# Altium schematic sheet other.SchDoc
size A2; SheetNumber: 3; SheetTotal: 3
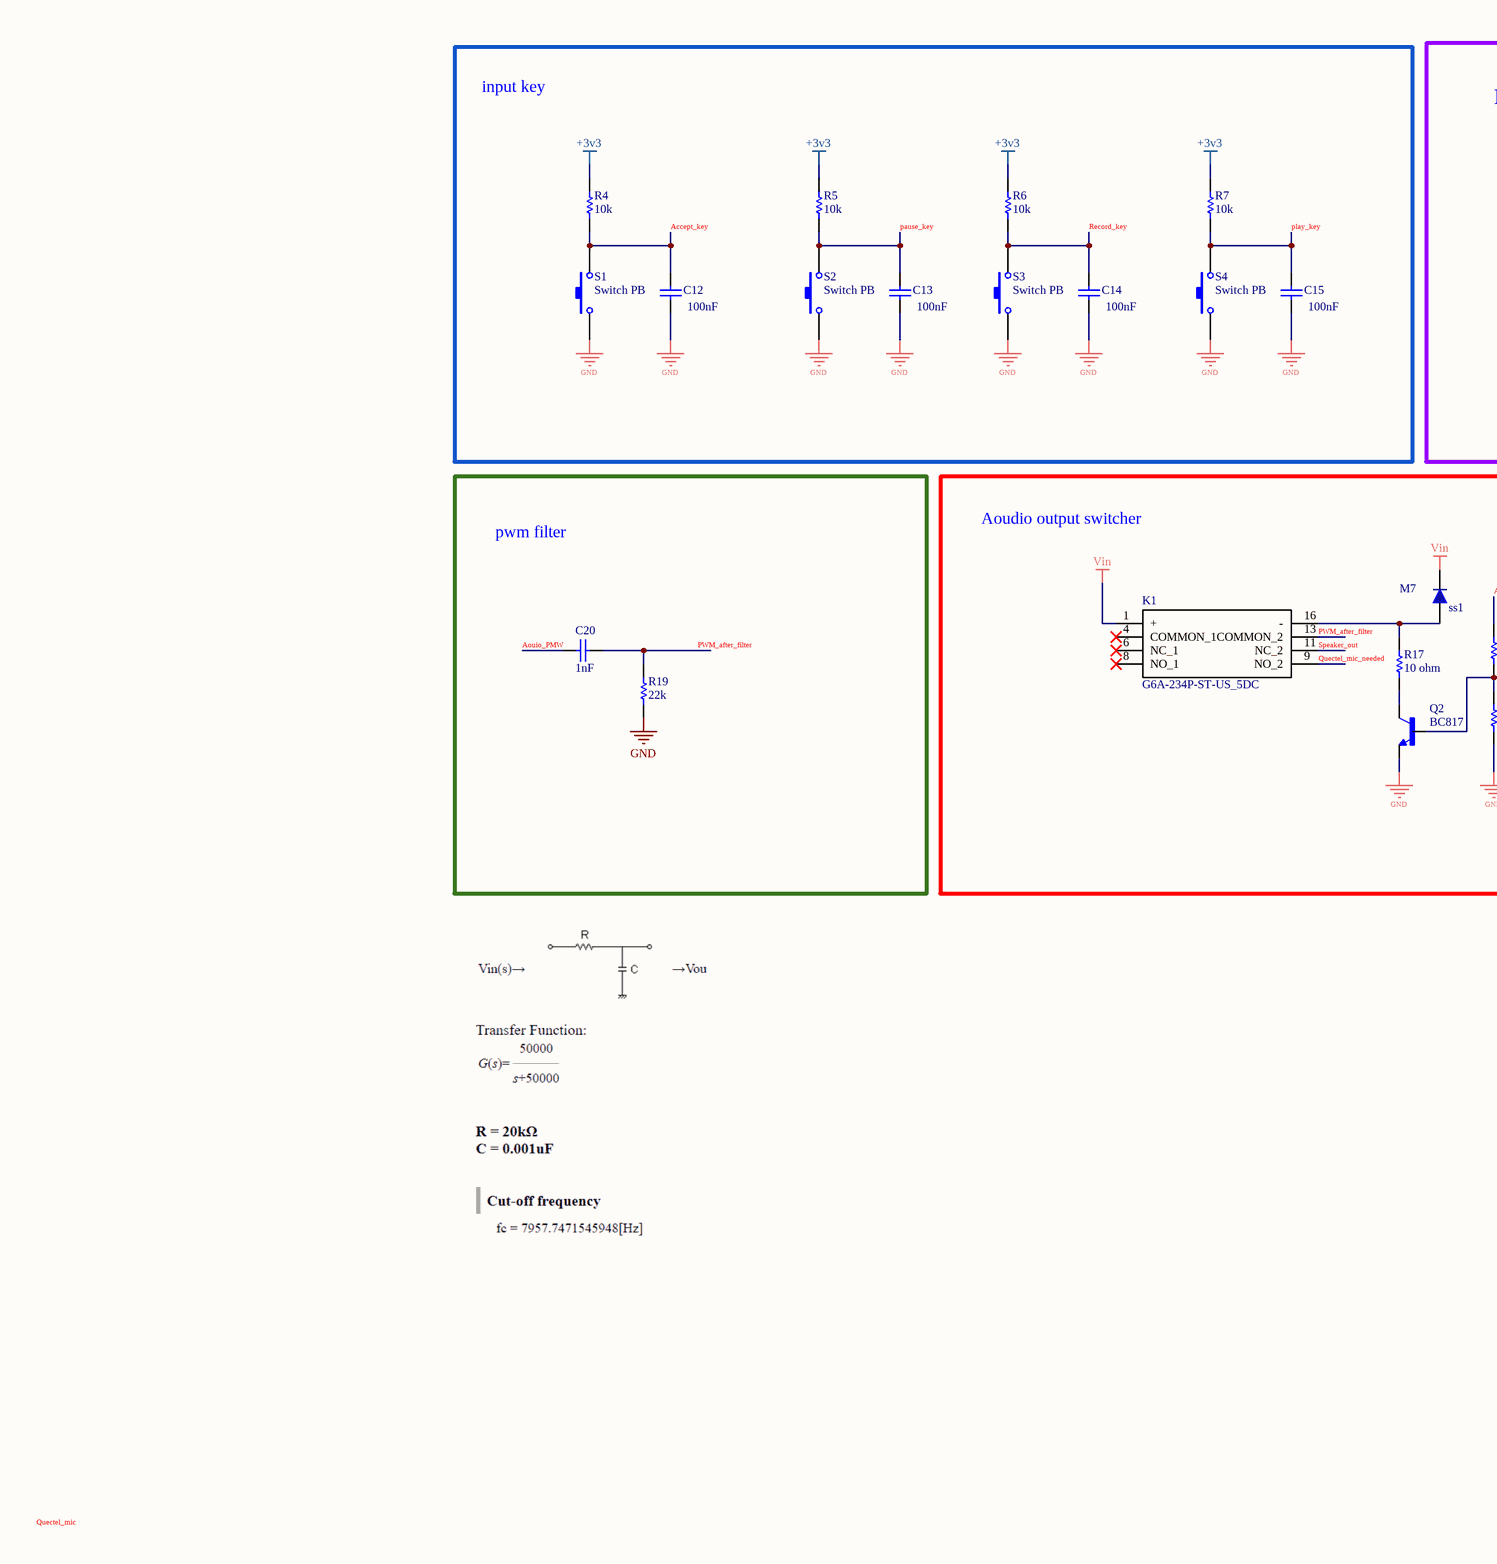
[diagram p0: other.SchDoc, left]
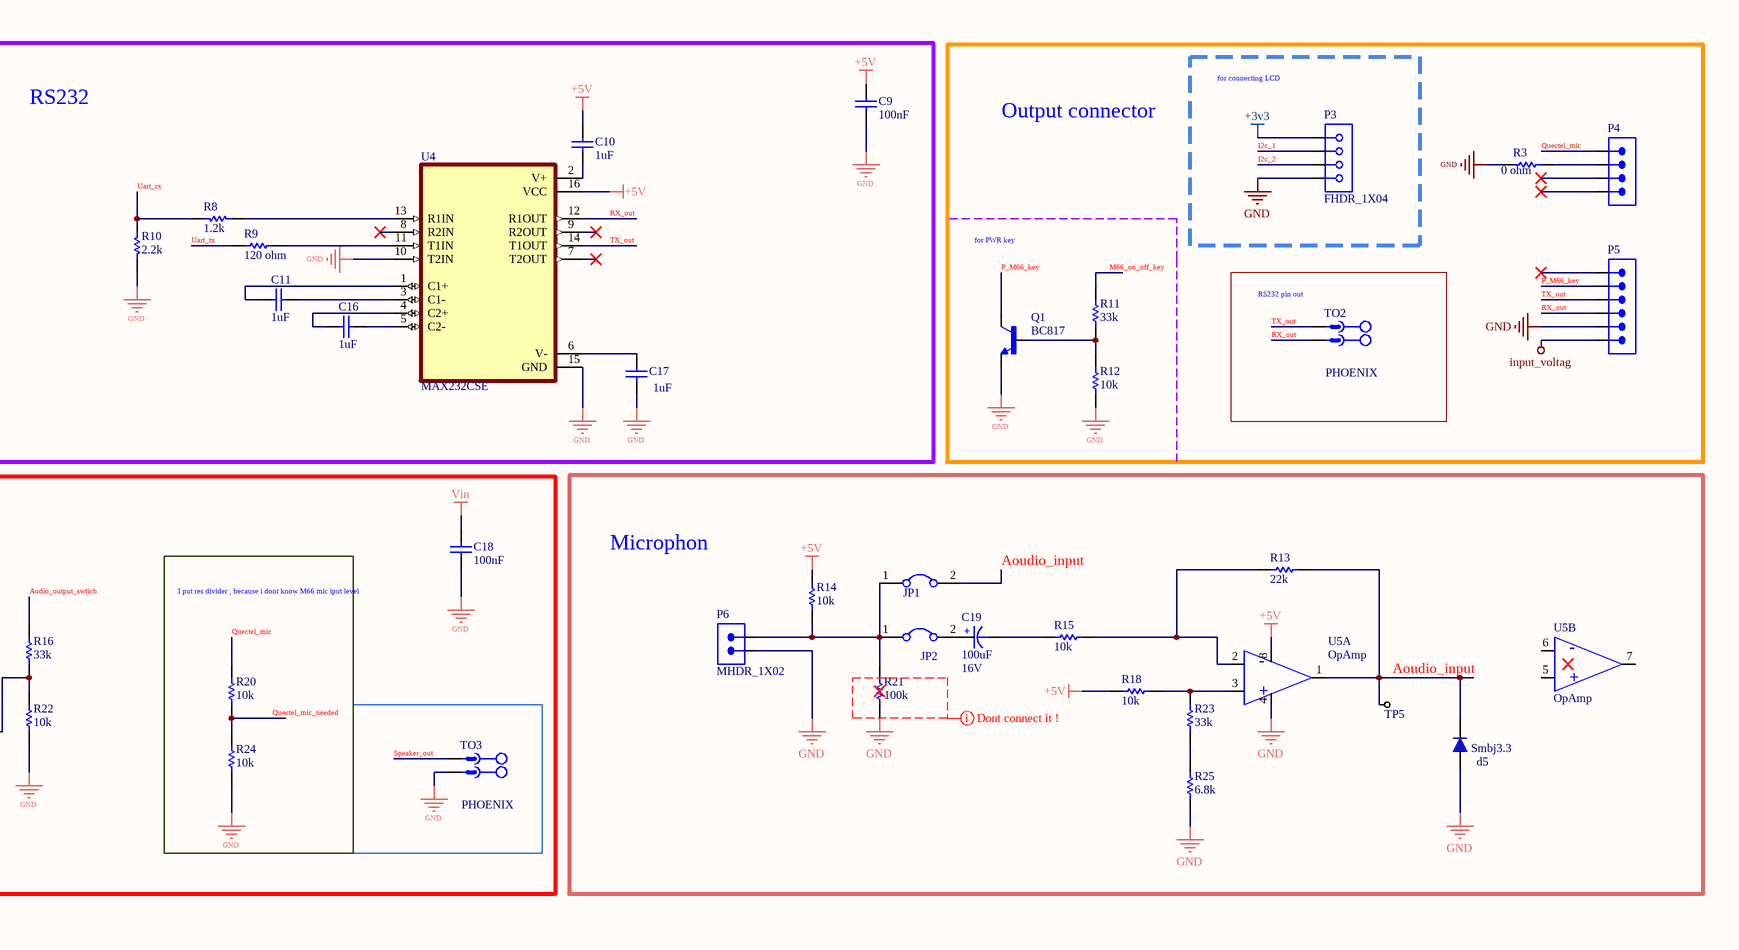
[diagram p1: other.SchDoc, right]

## Parts
C9  value 100nF  [CAP805]
C10  value 1uF  [CAP805]
C11  value 1uF  [CAP805]
C12  value 100nF  [CAP805]
C13  value 100nF  [CAP805]
C14  value 100nF  [CAP805]
C15  value 100nF  [CAP805]
C16  value 1uF  [CAP805]
C17  value 1uF  [CAP805]
C18  value 100nF  [CAP805]
C19  Voltage: 16V  [cap 03]  (hidden comment: 100uF)
C20  value 1nF  [CAP805]
d5  Smbj3.3  [DIODE SMA (DO-214AC)]
JP1  Jumper  [Jumper Small - 2.54 - GRAY]  (value not drawn)
JP2  Jumper  [Jumper Small - 2.54 - GRAY]  (value not drawn)
K1  G6A-234P-ST-US_5DC  [G6A234PSTUS5DC]
P3  FHDR_1X04  [FHDR1X04-254P]
P4  xh 4pin  [XH 4 PIN-S]  (value not drawn)
P5  xh 6pin  [XH 6 PIN-S]  (value not drawn)
P6  MHDR_1X02  [MHDR1X02-254P]
Q1  BC817  [SOT95P230X110-3N]
Q2  BC817  [SOT95P230X110-3N]
R3  0 ohm  [RES0805]
R4  10k  [RES0805]
R5  10k  [RES0805]
R6  10k  [RES0805]
R7  10k  [RES0805]
R8  1.2k  [RES0805]
R9  120 ohm  [RES0805]
R10  2.2k  [RES0805]
R11  33k  [RES0805]
R12  10k  [RES0805]
R13  22k  [RES0805]
R14  10k  [RES0805]
R15  10k  [RES0805]
R16  33k  [RES0805]
R17  10 ohm  [RES0805]
R18  10k  [RES0805]
R19  22k  [RES0805]
R20  10k  [RES0805]
R21  100k  [RES0805]
R22  10k  [RES0805]
R23  33k  [RES0805]
R24  10k  [RES0805]
R25  6.8k  [RES0805]
S1  Switch PB  [Switch - Push to On]
S2  Switch PB  [Switch - Push to On]
S3  Switch PB  [Switch - Push to On]
S4  Switch PB  [Switch - Push to On]
ss1  M7  [DIODE SMA (DO-214AC)]
TO2  PHOENIX  [CON_MSTBA02]
TO3  PHOENIX  [CON_MSTBA02]
TP5  (no value)  [TP10]
U4  MAX232CSE  [SOIC127P600X175-16N]
U5  OpAmp  [DIP8]  (parts A,B of 2)

## Blocks framed on the sheet
RS232: C9-C11 C16 C17 R8-R10 U4
input key: C12-C15 R4-R7 S1-S4
Output connector: P4 P5 Q1 R3 R11 R12
for connecting LCD: P3
RS232 pin out: TO2
Microphon: C19 d5 JP1 JP2 P6 R13-R15 R18 R21 R23 R25 TP5 U5
pwm filter: C20 R19
Aoudio output switcher: C18 K1 Q2 R16 R17 R22 ss1 TO3
I put res divider , because i dont know M66 mic iput level: R20 R24

## Nets
+3v3: P3.1 R4.2 R5.2 R6.2 R7.2
+5V: C9.1 C10.1 R14.2 R18.2 U4.16(VCC) U5.8(V+)
GND: C9.2 C12.1 C13.1 C14.1 C15.1 C17.1 C18.2 d5.1 P3.4 P5.5 P6.1 Q1.2(E) Q2.2(E) R3.2 R10.1 R12.2 R19.1 R21.2 R22.2 R24.2 R25.2 S1.1 S2.1 S3.1 S4.1 TO3.2 U4.10(T2IN) U4.15(GND) U5.4(V-)
input_voltag: P5.6
Vin: C18.1 K1.1(+) ss1.2
Accept_key: C12.2 R4.1 S1.2
Aoudio_input: d5.2 JP1.2 R13.1 TP5.1(TP) U5.1(Output)
Aouio_PMW: C20.2
Audio_output_swtich: R16.1
I2c_1: P3.2
I2c_2: P3.3
M66_on_off_key: R11.1
P_M66_key: P5.2 Q1.3(C)
pause_key: C13.2 R5.1 S2.2
play_key: C15.2 R7.1 S4.2
PWM_after_filter: C20.1 K1.13(COMMON_2) R19.2
Quectel_mic: P4.1 R20.1
Quectel_mic_needed: K1.9(NO_2) R20.2 R24.1
Record_key: C14.2 R6.1 S3.2
RX_out: P5.4 TO2.2 U4.12(R1OUT)
Speaker_out: K1.11(NC_2) TO3.1
TX_out: P5.3 TO2.1 U4.14(T1OUT)
Uart_rx: R8.1 R10.2
Uart_tx: R9.2
NetC10_2: C10.2 U4.2(V+)
NetC11_1: C11.1 U4.3(C1-)
NetC11_2: C11.2 U4.1(C1+)
NetC16_1: C16.1 U4.5(C2-)
NetC16_2: C16.2 U4.4(C2+)
NetC17_2: C17.2 U4.6(V-)
NetC19_1: C19.1(+) JP2.2
NetC19_2: C19.2(-) R15.2
NetJP1_1: JP1.1 JP2.1 P6.2 R14.1 R21.1
NetK1_16: K1.16(-) R17.1 ss1.1
NetP4_2: P4.2 R3.1
NetQ1_1: Q1.1(B) R11.2 R12.1
NetQ2_1: Q2.1(B) R16.2 R22.1
NetQ2_3: Q2.3(C) R17.2
NetR8_2: R8.2 U4.13(R1IN)
NetR9_1: R9.1 U4.11(T1IN)
NetR13_2: R13.2 R15.1 U5.2(Inverter_Input)
NetR18_1: R18.1 R23.1 U5.3(Noninverter_Input)
NetR23_2: R23.2 R25.1

Not connected (* = marked no-connect by the designer): K1 4(COMMON_1)* 6(NC_1)* 8(NO_1)*; P4 3* 4*; P5 1*; U4 7(T2OUT)* 8(R2IN)* 9(R2OUT)*; U5 5(Noninverter_Input) 6(Inverter_Input) 7(Output)

## Layout directives
mark named Dont connect it !: GND

## Notes on the sheet
- for PWR key
- Labels drawn without touching a wire or pin: Quectel_mic
- (in symbol OpAmp, part A) -; +
- (in symbol OpAmp, part B) -; +

## Library data of the parts
C9-C18 C20 = Cap: Capacitor; Published: 8-Jun-2000; LatestRevisionDate: 17-Jul-2002; LatestRevisionNote: Re-released for DXP Platform.; Publisher: Altium Limited
C19 = CAP_Polar: Polar Capacitor; Designer: Eng. Saeid Jorablo; Company: SJ Libraries; ComponentLink1Description: Datasheet; ComponentLink2Description: Reference; Publisher: SJ Unlimited; Mounting Technology: Surface Mount\Through-Hole; HelpURL: http://s3.picofile.com/file/7443264187/Coming_Soon_logo.gif; Status: Unreleased; Value: 100uF
d5 = 1n4007 SMD M7: Smbj5.0; Part. No: M7; Manufacturer: DC COMPONENTS; Designer: Abbas Basereh; Link: http://www.tme.eu/en/details/m7/smd-universal-diodes/dc-components/; Link: https://www.aliexpress.com/item/Smd-tube-1n4007-m7-SMA/1213719741.html?spm=2114.01010208.3.1.ZyZ7bC&ws_ab_test=searchweb0_0,searchweb201602_4_10065_10068_10084_10083_10080_10082_10081_10060_10061_10062_10056_10055_10054_10059_10099_10078_10079_427_10073_10103_10102_10096_10052_10050_10051,searchweb201603_4&btsid=db2be5ca-e560-400a-b91c-484ab5ee228b; Data: 16-12-2016
JP1 JP2 = Jumper: Company: E.P.I.L; Defualt State: Close; Design Date: 2011/11/02
K1 = G6A-234P-ST-US_5DC: Relay or Contactor; Manufacturer_Name: Omron Electronics; Manufacturer_Part_Number: G6A-234P-ST-US 5DC; Datasheet Link: https://componentsearchengine.com/Datasheets/2/G6A-234P-ST-US 5DC.pdf; Height: 8.4mm; Arrow Part Number: G6A-234P-ST-US 5DC; Arrow Price/Stock: https://www.arrow.com/en/products/g6a234pstus5dc/omron
P3 = FHDR_1X04: Female Header 1X04
P4 = MHDR_1X04
P5 = MHDR_1X06
P6 = MHDR_1X02: Male Header 1X02
Q1 Q2 = BC817: Transistor, Npn, 0.5a, 45v, Sot23; MF: {'manufacturer': u'Rectron'}; MP: BC817; Package: None; Availability: Unavailable; Price: None; Value: *
R3 R11 R12 R16 R17 R20 R22 R24 = RES 0805 0.125W_5: RES 0805; Designer: Abbas Basereh; Desc.: RES SMD 0805; Data: 16-12-2016
R4-R10 R13-R15 R18 R19 R21 R23 R25 = RES 0805 0.125W_1: RES 0805; Designer: Abbas Basereh; Desc.: RES SMD 0805; Data: 16-12-2016
S1-S4 = Switch PB: Push Button Switch
ss1 = 1n4007 SMD M7: Standard Rectifiers; Manufacturer: DC COMPONENTS; Designer: Abbas Basereh; Link: http://www.tme.eu/en/details/m7/smd-universal-diodes/dc-components/; Part. No: M7; Link: https://www.aliexpress.com/item/Smd-tube-1n4007-m7-SMA/1213719741.html?spm=2114.01010208.3.1.ZyZ7bC&ws_ab_test=searchweb0_0,searchweb201602_4_10065_10068_10084_10083_10080_10082_10081_10060_10061_10062_10056_10055_10054_10059_10099_10078_10079_427_10073_10103_10102_10096_10052_10050_10051,searchweb201603_4&btsid=db2be5ca-e560-400a-b91c-484ab5ee228b; Data: 16-12-2016
TO2 TO3 = CON_Phoenix_MSTB_02: 2 Pitch: 5.08 mm Color: green Contact surface: Tin Assembly; Manufacturer: PHOENIX CONTACT; Connector type: PCB Terminal Block; designer: ABBAS BASEREH; Max Current: 12 A; Positions: 2; Voltage: 320 V; Category: Connector; ComponentLink1Description: Header, Nominal current: 12 A Rated voltage (III/2): 320 V Number of positions: 2 Pitch: 5.08 mm Color: green Contact surface: Tin Assembly: Soldering  DESIGNER:ABBAS BASEREH; ComponentLink2Description: Reference; Mounting Technology: Through-Hole; Pin Count: 2; Revision 1: 2017-3-1; Status: Unreleased; PART.NO: PHOENIX
TP5 = Test Point: Company: SJ Libraries; Designer: Eng. Saeid Jorablo; Mounting Technology: Surface Mount\Through-Hole; ComponentLink1Description: Datasheet; Pin Count: 0; Update Date: 6/3/2012; Category: MISC; HelpURL: http://s3.picofile.com/file/7443264187/Coming_Soon_logo.gif
U4 = MAX232CSE: MF: {'manufacturer': u'Analog Devices'}; Package: None; Price: None; Value: *; MP: MAX232CSE; Availability: Unavailable
U5 = OpAmp: Dual Low Noise Operational Amplifier (OpAmp)